# Altium schematic sheet PD1_5 _S2.SchDoc: Sample Sheet Title
size B; Date: MM/DD/YYYY; Author: Sample Author; Organization: ORGANIZATION; Address1: ADDRESS 1; Address2: ADDRESS 2; Address3: ADDRESS 3; Address4: ADDRESS 4; Revision: -; SheetNumber: 2; SheetTotal: 2; ENG_APP_DATE: --/--/--; DSN_APP_DATE: --/--/--; CHK_APP_DATE: --/--/--
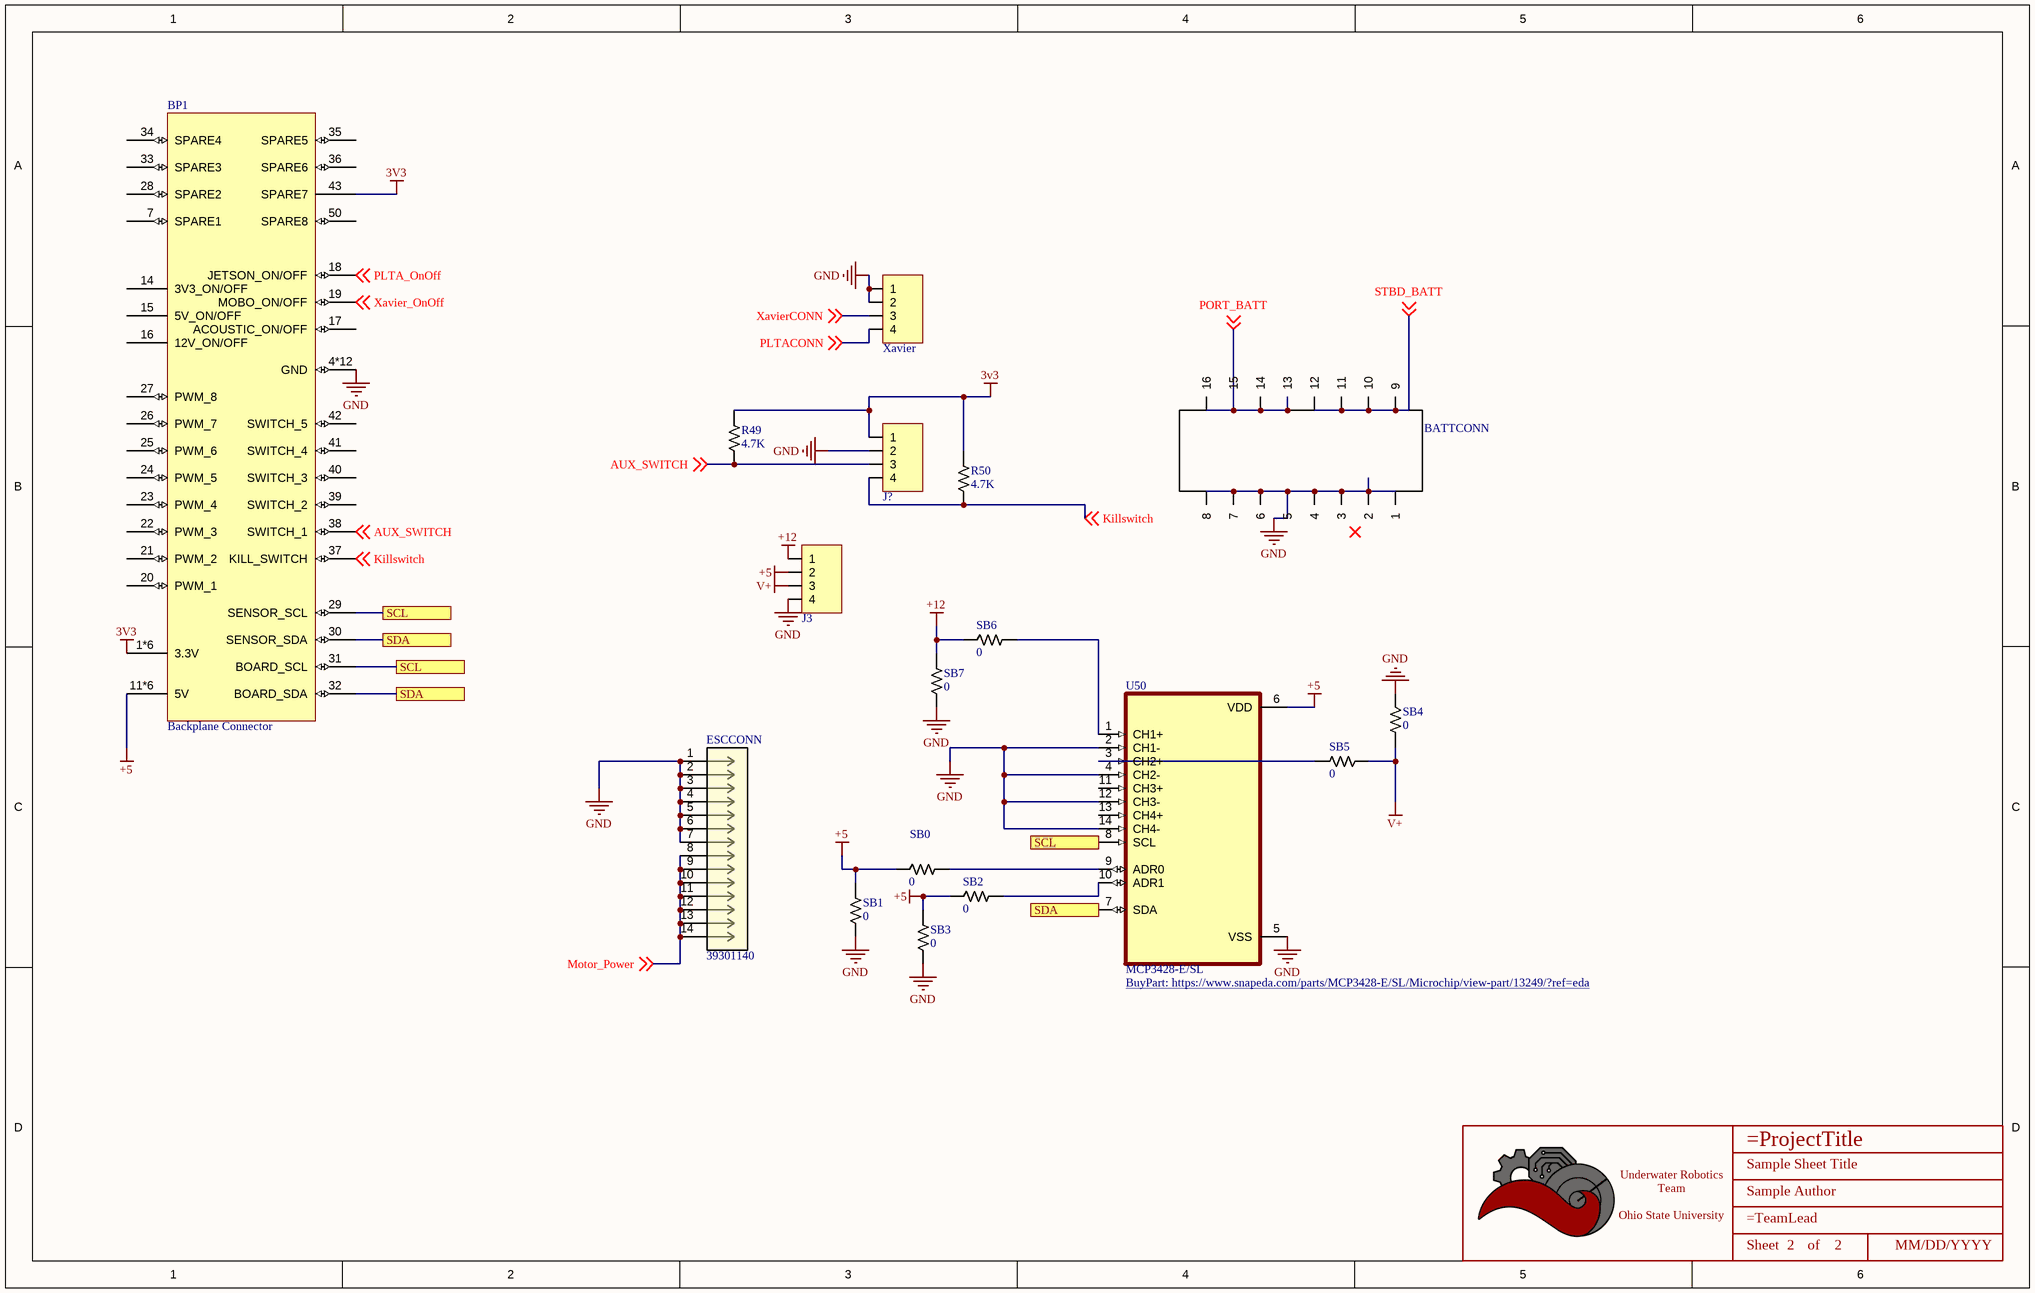
[diagram p0: PD1_5 _S2.SchDoc]

## Parts
*  Title_Block  [LOGO]  (value not drawn)  (graphical)
BATTCONN  BatteryConnector  [CONN_MOLEX_MINIFIT JR_16 POS_R/A - duplicate]  (value not drawn)
BP1  Backplane Connector  [BACKPLANE_EDGE_CONN]
ESCCONN  39301140  [CON_39301140]
J3  4 POS R/A  [CONN_MOLEX_MINIFIT JR_4 POS_R/A]  (value not drawn)
J?  4 POS R/A  [CONN_MOLEX_MINIFIT JR_4 POS_R/A]  (value not drawn)
R49  Value  (Ohms): 4.7K  [RESISTOR_0805]  (hidden comment: 4.7k Ohm 5% 1/8W)
R50  Value  (Ohms): 4.7K  [RESISTOR_0805]  (hidden comment: 4.7k Ohm 5% 1/8W)
SB0  Value  (Ohms): 0  [RESISTOR_0603]  (hidden comment: 0 Ohm Jumper No Fit)
SB1  Value  (Ohms): 0  [RESISTOR_0603]  (hidden comment: 0 Ohm Jumper No Fit)
SB2  Value  (Ohms): 0  [RESISTOR_0603]  (hidden comment: 0 Ohm Jumper No Fit)
SB3  Value  (Ohms): 0  [RESISTOR_0603]  (hidden comment: 0 Ohm Jumper No Fit)
SB4  Value  (Ohms): 0  [RESISTOR_0603]  (hidden comment: 0 Ohm Jumper No Fit)
SB5  Value  (Ohms): 0  [RESISTOR_0603]  (hidden comment: 0 Ohm Jumper No Fit)
SB6  Value  (Ohms): 0  [RESISTOR_0603]  (hidden comment: 0 Ohm Jumper No Fit)
SB7  Value  (Ohms): 0  [RESISTOR_0603]  (hidden comment: 0 Ohm Jumper No Fit)
U50  MCP3428-E/SL  [SOIC127P600X175-14N]
Xavier  4 POS R/A  [CONN_MOLEX_MINIFIT JR_4 POS_R/A]  (value not drawn)

## Ports
SCL, SDA

## Nets
3V3: BP1.1*6(3.3V) BP1.43(SPARE7) J?.1 R49.1 R50.1
+5: BP1.11*6(5V) J3.2 SB0.2 SB1.1 SB2.2 SB3.1 U50.6(VDD)
+12: J3.1 SB6.2 SB7.1
GND: BATTCONN.1 BATTCONN.2 BATTCONN.3 BATTCONN.4 BATTCONN.5 BATTCONN.6 BATTCONN.7 BATTCONN.8 BP1.4*12(GND) ESCCONN.1 ESCCONN.2 ESCCONN.3 ESCCONN.4 ESCCONN.5 ESCCONN.6 ESCCONN.7 J3.4 J?.2 SB1.2 SB3.2 SB4.2 SB7.2 U50.2(CH1-) U50.4(CH2-) U50.5(VSS) U50.12(CH3-) U50.14(CH4-) Xavier.1 Xavier.2
V+: J3.3 SB4.1 SB5.2
AUX_SWITCH: BP1.38(SWITCH_1) J?.3 R49.2 ; off-sheet AUX_SWITCH
Killswitch: BP1.37(KILL_SWITCH) J?.4 R50.2 ; off-sheet Killswitch
Motor_Power: ESCCONN.8 ESCCONN.9 ESCCONN.10 ESCCONN.11 ESCCONN.12 ESCCONN.13 ESCCONN.14 ; off-sheet Motor_Power
PLTA_OnOff: BP1.18(JETSON_ON/OFF) ; off-sheet PLTA_OnOff
PLTACONN: Xavier.4 ; off-sheet PLTACONN
PORT_BATT: BATTCONN.13 BATTCONN.14 BATTCONN.15 BATTCONN.16 ; off-sheet PORT_BATT
SCL: BP1.29(SENSOR_SCL) BP1.31(BOARD_SCL) U50.8(SCL) ; port SCL
SDA: BP1.30(SENSOR_SDA) BP1.32(BOARD_SDA) U50.7(SDA) ; port SDA
STBD_BATT: BATTCONN.9 BATTCONN.10 BATTCONN.11 BATTCONN.12 ; off-sheet STBD_BATT
Xavier_OnOff: BP1.19(MOBO_ON/OFF) ; off-sheet Xavier_OnOff
XavierCONN: Xavier.3 ; off-sheet XavierCONN
NetSB0_1: SB0.1 U50.9(ADR0)
NetSB2_1: SB2.1 U50.10(ADR1)
NetSB5_1: SB5.1 U50.3(CH2+)
NetSB6_1: SB6.1 U50.1(CH1+)

Not connected (* = marked no-connect by the designer): BP1 7(SPARE1) 14(3V3_ON/OFF) 15(5V_ON/OFF) 16(12V_ON/OFF) 17(ACOUSTIC_ON/OFF) 20(PWM_1) 21(PWM_2) 22(PWM_3) 23(PWM_4) 24(PWM_5) 25(PWM_6) 26(PWM_7) 27(PWM_8) 28(SPARE2) 33(SPARE3) 34(SPARE4) 35(SPARE5) 36(SPARE6) 39(SWITCH_2) 40(SWITCH_3) 41(SWITCH_4) 42(SWITCH_5) 50(SPARE8); U50 11(CH3+) 13(CH4+)

## Notes on the sheet
- DWG. NO.
- REV.
- SHT.
- THIS DOCUMENT AND THE DATA DISCLOSED HEREIN OR HEREWITH IS THE PROPERTY OF ALTIUM LIMITED AND MAY BE FREELY DISTRIBUTED IN WHOLE. NO RIGHTS ARE RESERVED OR EXPRESS OR IMPLIED WARANTEE GIVEN.
- REVISION
- DESCRIPTION
- DATE
- APPROVED
- ENG:
- APPROVALS
- PROJECT
- DSN:
- CHK:
- REFERENCE DOCUMENTS
- PROJECT REVISION:
- TITLE
- DOCUMENT REVISION:
- DESIGN ITEM:
- BOM:
- FAB DWG:
- PCB DWG:
- ASSY DWG:
- SCALE:
- SIZE
- B
- CAGE CODE
- FILE NAME
- DWG NO.
- SHEET
- OF
- REV
- (in symbol Title_Block) Underwater Robotics Team / Ohio State University; Sheet; of

## Library data of the parts
* = Title_Block: UWRT Schematic Title Block Template / Created June 2021, Dylan Trainor
BP1 = BACKPLANE_EDGE_CONN: Titan Backplane Edge Connector; pin to pad: 1*6>1+2+3+54+55+56 4*12>4+5+6+8+9+10+47+48+49+51+52+53 11*6>11+12+13+44+45+46
ESCCONN = 39301140: No Description Available; Mfr_Name: Molex Connector Corporation; Copyright: Copyright (C) 2022 Ultra Librarian. All rights reserved.; Manufacturer_Part_Number: 39301140; RefDes: RefDes; Type: DEV
J3 J? Xavier = CONN_MOLEX_MINIFIT JR_4POS_R/A: Molex Minifit Jr. 5569 / 4 Pos R/A Natural; Pitch: 4.2mm; Configuration: Right Angle; Current Per Pin: 13A; Number of Positions: 4; Supplier Part Number 1: WM13112-ND; Supplier 1: Digi-Key; Manufacturer: Molex; Color: Natural; Created By: Flip B; ComponentLink1Description: Datasheet; ComponentLink1URL: https://www.molex.com/pdm_docs/sd/026013115_sd.pdf; Series: Minifit Jr 5569
R49 R50 = RESISTOR_4.7K_0805: RES 4.7k OHM 5% 1/8W 0805; Tolerance: +/- 5%; Made By: Robert Pafford; ComponentLink1Description: Datasheet; Wattage: 1/8W; Supplier: Digikey; Digikey Part Numer: CR0603-JW-104ELFTR-ND
SB0-SB7 = JUMPER_0_0603: 0 Ohm Jumper No Fit for Solder Bridge; Made By: Robert Pafford; ComponentLink1Description: Digikey; ComponentLink1URL: https://www.digikey.com/en/products/detail/koa-speer-electronics-inc/RK73B1JTTD101J/9844701
U50 = MCP3428-E/SL: 16 Bit Analog to Digital Converter 4 Input 1 Sigma-Delta 14-SOIC; MF: Microchip; Package: SOIC-14 Microchip; SnapEDA_Link: https://www.snapeda.com/parts/MCP3428-E/SL/Microchip/view-part/13249/?ref=snap; MP: MCP3428-E/SL; Price: None; Availability: Unavailable; Value: *; BuyPart: https://www.snapeda.com/parts/MCP3428-E/SL/Microchip/view-part/13249/?ref=eda